# Altium project PCB_Project1.PrjPCB
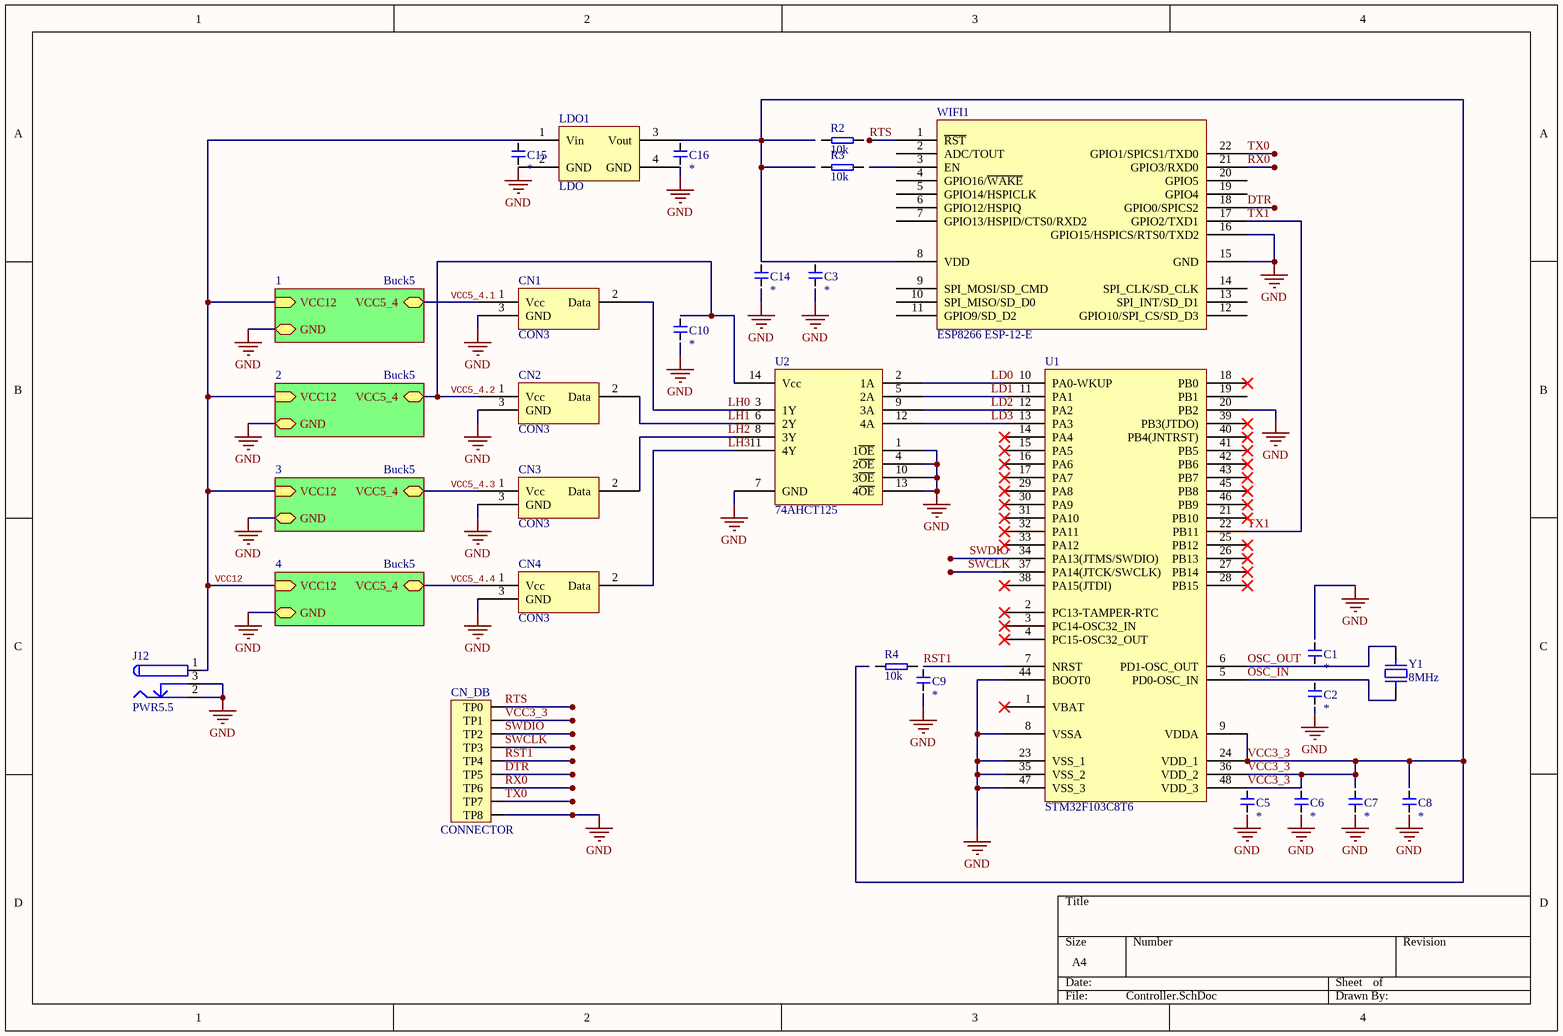
[diagram p0: Controller.SchDoc]
3 sheets, 67 parts. Net scope: hierarchical (ports join the sheet entries above them; power ports are global).
Board file: Controller.PcbDoc
Sheets:
  Controller.SchDoc
    1 = Buck5.SchDoc
    2 = Buck5.SchDoc
    3 = Buck5.SchDoc
    4 = Buck5.SchDoc
  Buck.SchDoc

## Sheet Controller.SchDoc
size A4

### Parts
(Parts that share a designator on the sheet are numbered #1, #2 ... from top to bottom, then left to right.)
C1#1  *  [CAP 0603/1608]
C2#1  *  [CAP 0603/1608]
C3  *  [CAP 0603/1608]
C5  *  [CAP 0603/1608]
C6  *  [CAP 0603/1608]
C7  *  [CAP 0603/1608]
C8  *  [CAP 0603/1608]
C9  *  [CAP 0603/1608]
C10  *  [CAP 0603/1608]
C14  *  [CAP 0603/1608]
C15  *  [CAP 0603/1608]
C16  *  [CAP 0603/1608]
CN1  CON3  [LEDCON3]  (no BOM)
CN2  CON3  [LEDCON3]  (no BOM)
CN3  CON3  [LEDCON3]  (no BOM)
CN4  CON3  [LEDCON3]  (no BOM)
CN_DB  CONNECTOR  [Edge Connector]  (no BOM)
J12  PWR5.5  [DC_CON]
LDO1  LDO  [SOT230P700X180-4N]
R2#1  10k  [RES 0603/1608]
R3  10k  [RES 0603/1608]
R4  10k  [RES 0603/1608]
U1#1  STM32F103C8T6  [CQFP50P900X900X160-48N]
U2  74AHCT125  [SOIC127P600X173-14N]
WIFI1  ESP8266 ESP-12-E  [ESP8266 ESP-12-E]
Y1  8MHz  [CRYSTAL]

### Sub-sheets
1 = Buck5: GND (bidir), VCC5_4, VCC12 (in)
2 = Buck5: GND (bidir), VCC5_4, VCC12 (in)
3 = Buck5: GND (bidir), VCC5_4, VCC12 (in)
4 = Buck5: GND (bidir), VCC5_4, VCC12 (in)

### Nets
GND: CN1.3(GND) CN2.3(GND) CN3.3(GND) CN4.3(GND) CN_DB.9(TP8) J12.2 J12.3 LDO1.2(GND) LDO1.4(GND) U1#1.8(VSSA) U1#1.20(PB2) U1#1.23(VSS_1) U1#1.35(VSS_2) U1#1.44(BOOT0) U1#1.47(VSS_3) U2.1(1~{OE}) U2.4(2~{OE}) U2.7(GND) U2.10(3~{OE}) U2.13(4~{OE}) WIFI1.15(GND) WIFI1.16(GPIO15/HSPICS/RTS0/TXD2) ; sheet 1/GND, sheet 2/GND, sheet 3/GND, sheet 4/GND
DTR: CN_DB.6(TP5) WIFI1.18(GPIO0/SPICS2)
LD0: U1#1.10(PA0-WKUP) U2.2(1A)
LD1: U1#1.11(PA1) U2.5(2A)
LD2: U1#1.12(PA2) U2.9(3A)
LD3: U1#1.13(PA3) U2.12(4A)
LH0: CN1.2(Data) U2.3(1Y)
LH1: CN2.2(Data) U2.6(2Y)
LH2: CN3.2(Data) U2.8(3Y)
LH3: CN4.2(Data) U2.11(4Y)
OSC_IN: U1#1.5(PD0-OSC_IN) Y1.1
OSC_OUT: U1#1.6(PD1-OSC_OUT) Y1.2
RST1: CN_DB.5(TP4) U1#1.7(NRST)
RTS: CN_DB.1(TP0) WIFI1.1(~{RST})
RX0: CN_DB.7(TP6) WIFI1.21(GPIO3/RXD0)
SWCLK: CN_DB.4(TP3) U1#1.37(PA14(JTCK/SWCLK))
SWDIO: CN_DB.3(TP2) U1#1.34(PA13(JTMS/SWDIO))
TX0: CN_DB.8(TP7) WIFI1.22(GPIO1/SPICS1/TXD0)
TX1: U1#1.22(PB11) WIFI1.17(GPIO2/TXD1)
VCC3_3: CN_DB.2(TP1) LDO1.3(Vout) U1#1.9(VDDA) U1#1.24(VDD_1) U1#1.36(VDD_2) U1#1.48(VDD_3) WIFI1.8(VDD)
VCC5_4.1: CN1.1(Vcc) ; sheet 1/VCC5_4  [project net VCC5_4]
VCC5_4.2: CN2.1(Vcc) U2.14(Vcc) ; sheet 2/VCC5_4  [project net VCC5_4]
VCC5_4.3: CN3.1(Vcc) ; sheet 3/VCC5_4  [project net VCC5_4]
VCC5_4.4: CN4.1(Vcc) ; sheet 4/VCC5_4  [project net VCC5_4]
VCC12: J12.1 LDO1.1(Vin) ; sheet 1/VCC12, sheet 2/VCC12, sheet 3/VCC12, sheet 4/VCC12

Not connected (* = marked no-connect by the designer): C1#1 1 2; C2#1 1 2; C3 1 2; C5 1 2; C6 1 2; C7 1 2; C8 1 2; C9 1 2; C10 1 2; C14 1 2; C15 1 2; C16 1 2; R2#1 1 2; R3 1 2; R4 1 2; U1#1 1(VBAT)* 2(PC13-TAMPER-RTC)* 3(PC14-OSC32_IN)* 4(PC15-OSC32_OUT)* 14(PA4)* 15(PA5)* 16(PA6)* 17(PA7)* 18(PB0)* 19(PB1) 21(PB10)* 25(PB12)* 26(PB13)* 27(PB14)* 28(PB15)* 29(PA8)* 30(PA9)* 31(PA10)* 32(PA11)* 33(PA12)* 38(PA15(JTDI))* 39(PB3(JTDO))* 40(PB4(JNTRST))* 41(PB5)* 42(PB6)* 43(PB7)* 45(PB8)* 46(PB9)*; WIFI1 2(ADC/TOUT) 3(EN) 4(GPIO16/~{WAKE}) 5(GPIO14/HSPICLK) 6(GPIO12/HSPIQ) 7(GPIO13/HSPID/CTS0/RXD2) 9(SPI_MOSI/SD_CMD) 10(SPI_MISO/SD_D0) 11(GPIO9/SD_D2) 12(GPIO10/SPI_CS/SD_D3) 13(SPI_INT/SD_D1) 14(SPI_CLK/SD_CLK) 19(GPIO4) 20(GPIO5)

### Notes on the sheet
- Labels drawn without touching a wire or pin: GND

### Library data of the parts
C1#1 C2#1 C3 C5-C10 C14-C16 = CAP: Capacitor; Note: *; Desc: *; Value: *
J12 = PWR2.5: Low Voltage Power Supply Connector; Published: 17-Dec-2003; DatasheetDocument: 09-May-2002; Publisher: Altium Limited; ComponentLink1Description: Manufacturer Link; ComponentLink1URL: http://domino.kycon.com/internet/Products.html
R2#1 R3 R4 = RES: Resistor; Value: 10k; Note: *; Desc: *
U1#1 = STM32F103C8T6: Medium-density performance line ARM-based 32-bit MCU with 64 or 128 KB Flash, USB, CAN, 7 timers, 2 ADCs, 9 com. interfaces
Y1 = CRYSTAL: SMT Crystal; VALUE: 8MHz

## Sheet Buck5.SchDoc
size A4
Used 4 times, as channels 1, 2, 3, 4. Parts and nets are listed once, with the designators drawn on the sheet.
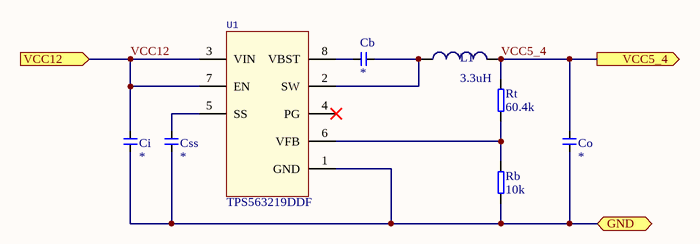
[diagram p1: Buck5.SchDoc]

### Parts
Cb  *  [CAP 0603/1608]
Ci  *  [CAP 0603/1608]
Co  *  [CAP 0603/1608]
Css  *  [CAP 0603/1608]
L1  3.3uH  [INDUCTOR PCC-M0530M3R3KVP]
Rb  10k  [RES 0603/1608]
Rt  60.4k  [RES 0603/1608]
U1  TPS563219DDF  [TSOP65P280X110-8N]

### Ports
GND (bidir), VCC5_4 (out), VCC12 (in)

### Nets
GND: Ci.2 Co.2 Css.2 Rb.1 U1.1(GND) ; port GND
VCC5_4: Co.1 L1.2 Rt.2 ; port VCC5_4
VCC12: Ci.1 U1.3(VIN) U1.7(EN) ; port VCC12
NetCb_1: Cb.1 L1.1 U1.2(SW)
NetCb_2: Cb.2 U1.8(VBST)
NetCss_1: Css.1 U1.5(SS)
NetRb_2: Rb.2 Rt.1 U1.6(VFB)

Not connected (* = marked no-connect by the designer): U1 4(PG)*

### Channels
1: designators end in .1; ports GND=GND VCC5_4=VCC5_4 VCC12=VCC12
2: designators end in .2; ports GND=GND VCC5_4=VCC5_4 VCC12=VCC12
3: designators end in .3; ports GND=GND VCC5_4=VCC5_4 VCC12=VCC12
4: designators end in .4; ports GND=GND VCC5_4=VCC5_4 VCC12=VCC12

### Library data of the parts
Cb Ci Co Css = CAP: Capacitor; Note: *; Desc: *; Value: *
L1 = Inductor: Code_IEC: 1005; Published: 8-Jun-2000; LatestRevisionDate: 29-May-2009; LatestRevisionNote: IPC-7351 Footprint Added.; PackageReference: 0402-A; Publisher: Altium Limited; PackageDescription: Chip Inductor; Code_JEITA: 0402; Value: 3.3uH
Rb Rt = RES: Resistor; Note: *; Desc: *
  Rb: Value: 10k
  Rt: Value: 60.4k

## Sheet Buck.SchDoc
size A4
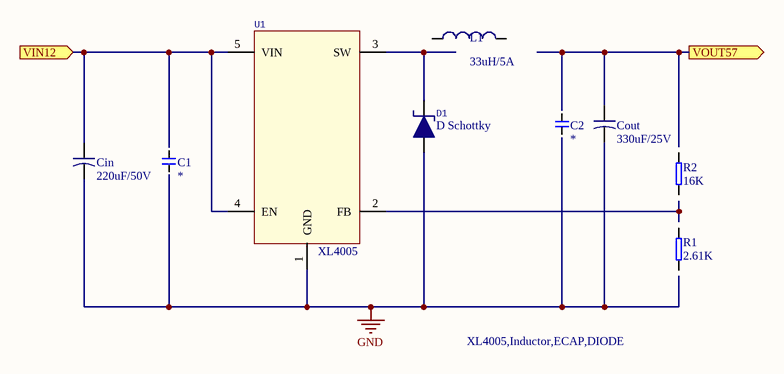
[diagram p2: Buck.SchDoc]

### Parts
(Parts that share a designator on the sheet are numbered #1, #2 ... from top to bottom, then left to right.)
C1#2  *  [CAP 0603/1608]
C2#2  *  [CAP 0603/1608]
Cin  220uF/50V
Cout  330uF/25V
D1  D Schottky
L1  value 33uH/5A  [INDUCTOR PCC-M0530M3R3KVP]  (hidden comment: Inductor)
R1  2.61K  [RES 0603/1608]
R2#2  16K  [RES 0603/1608]
U1#2  XL4005

### Ports
VIN12, VOUT57 (out)

### Nets
GND: Cin.2 Cout.2 D1.2 U1#2.1(GND)
VIN12: Cin.1 U1#2.4(EN) U1#2.5(VIN) ; port VIN12
VOUT57: Cout.1 ; port VOUT57
NetD1_1: D1.1 U1#2.3(SW)

Not connected (* = marked no-connect by the designer): C1#2 1 2; C2#2 1 2; L1 1 2; R1 1 2; R2#2 1 2; U1#2 2(FB)

### Notes on the sheet
- XL4005,Inductor,ECAP,DIODE

### Library data of the parts
C1#2 C2#2 = CAP: Capacitor; Note: *; Desc: *; Value: *
Cin Cout = E CAP
  Cin: Value: 220uF/50V
  Cout: Value: 330uF/25V
L1 = Inductor: Code_IEC: 1005; Published: 8-Jun-2000; LatestRevisionDate: 29-May-2009; LatestRevisionNote: IPC-7351 Footprint Added.; PackageReference: 0402-A; Publisher: Altium Limited; PackageDescription: Chip Inductor; Code_JEITA: 0402
R1 R2#2 = RES: Resistor; Note: *; Desc: *
  R1: Value: 2.61K
  R2#2: Value: 16K
U1#2 = XL4005: Buck Regulator

## Nets that join several sheets
GND: Controller (22 pins), 1 (5 pins), 2 (5 pins), 3 (5 pins), 4 (5 pins), Buck (Cin.2 Cout.2 D1.2 U1#2.1)
VCC5_4: Controller (CN2.1 U2.14), 2 (Co.2.1 L1.2.2 Rt.2.2)
VCC5_4: Controller (CN1.1), 1 (Co.1.1 L1.1.2 Rt.1.2)
VCC5_4: Controller (CN3.1), 3 (Co.3.1 L1.3.2 Rt.3.2)
VCC5_4: Controller (CN4.1), 4 (Co.4.1 L1.4.2 Rt.4.2)
VCC12: Controller (J12.1 LDO1.1), 1 (Ci.1.1 U1.1.3 U1.1.7), 2 (Ci.2.1 U1.2.3 U1.2.7), 3 (Ci.3.1 U1.3.3 U1.3.7), 4 (Ci.4.1 U1.4.3 U1.4.7)